# Altium schematic sheet MICROSD_EM_V1.SchDoc
size A4
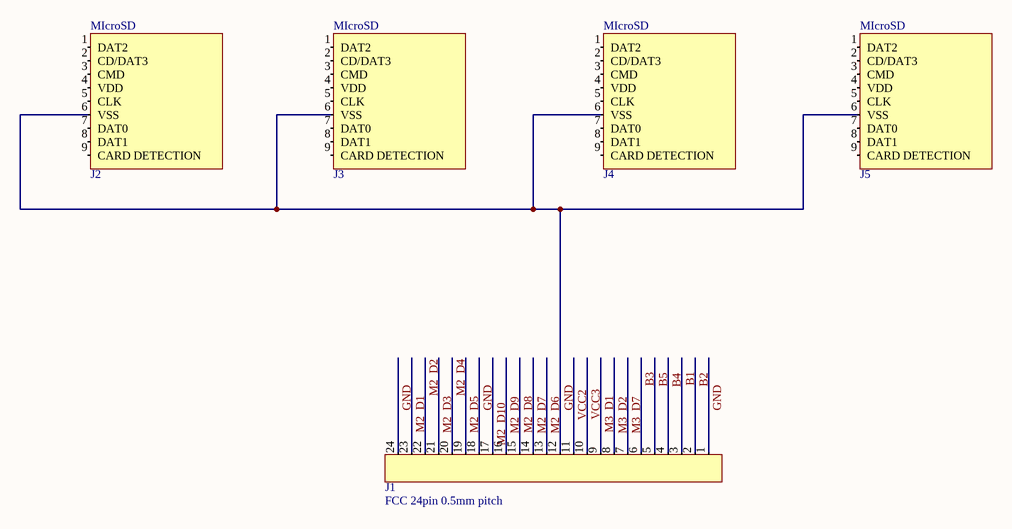
[diagram p0: MICROSD_EM_V1.SchDoc]

## Parts
(Parts that share a designator on the sheet are numbered #1, #2 ... from top to bottom, then left to right.)
J1  FCC 24pin 0.5mm pitch  [FCC_24P_0.5MM]
MIcroSD#1  J2  [MicroSD_Ali]
MIcroSD#2  J3  [MicroSD_Ali]
MIcroSD#3  J4  [MicroSD_Ali]
MIcroSD#4  J5  [MicroSD_Ali]

## Nets
B1: J1.3
B2: J1.2
B3: J1.6
B4: J1.4
B5: J1.5
GND: J1.1 J1.12 J1.18 J1.24 MIcroSD#1.6(VSS) MIcroSD#2.6(VSS) MIcroSD#3.6(VSS) MIcroSD#4.6(VSS)
M2_D1: J1.23
M2_D2: J1.22
M2_D3: J1.21
M2_D4: J1.20
M2_D5: J1.19
M2_D6: J1.13
M2_D7: J1.14
M2_D8: J1.15
M2_D9: J1.16
M2_D10: J1.17
M3_D1: J1.9
M3_D2: J1.8
M3_D7: J1.7
VCC2: J1.11
VCC3: J1.10

Not connected (* = marked no-connect by the designer): MIcroSD#1 1(DAT2) 2(CD/DAT3) 3(CMD) 4(VDD) 5(CLK) 7(DAT0) 8(DAT1) 9(CARD_DETECTION); MIcroSD#2 1(DAT2) 2(CD/DAT3) 3(CMD) 4(VDD) 5(CLK) 7(DAT0) 8(DAT1) 9(CARD_DETECTION); MIcroSD#3 1(DAT2) 2(CD/DAT3) 3(CMD) 4(VDD) 5(CLK) 7(DAT0) 8(DAT1) 9(CARD_DETECTION); MIcroSD#4 1(DAT2) 2(CD/DAT3) 3(CMD) 4(VDD) 5(CLK) 7(DAT0) 8(DAT1) 9(CARD_DETECTION)

## Library data of the parts
J1 = FCC_24P_0.5MM
MIcroSD#1-MIcroSD#4 = J?